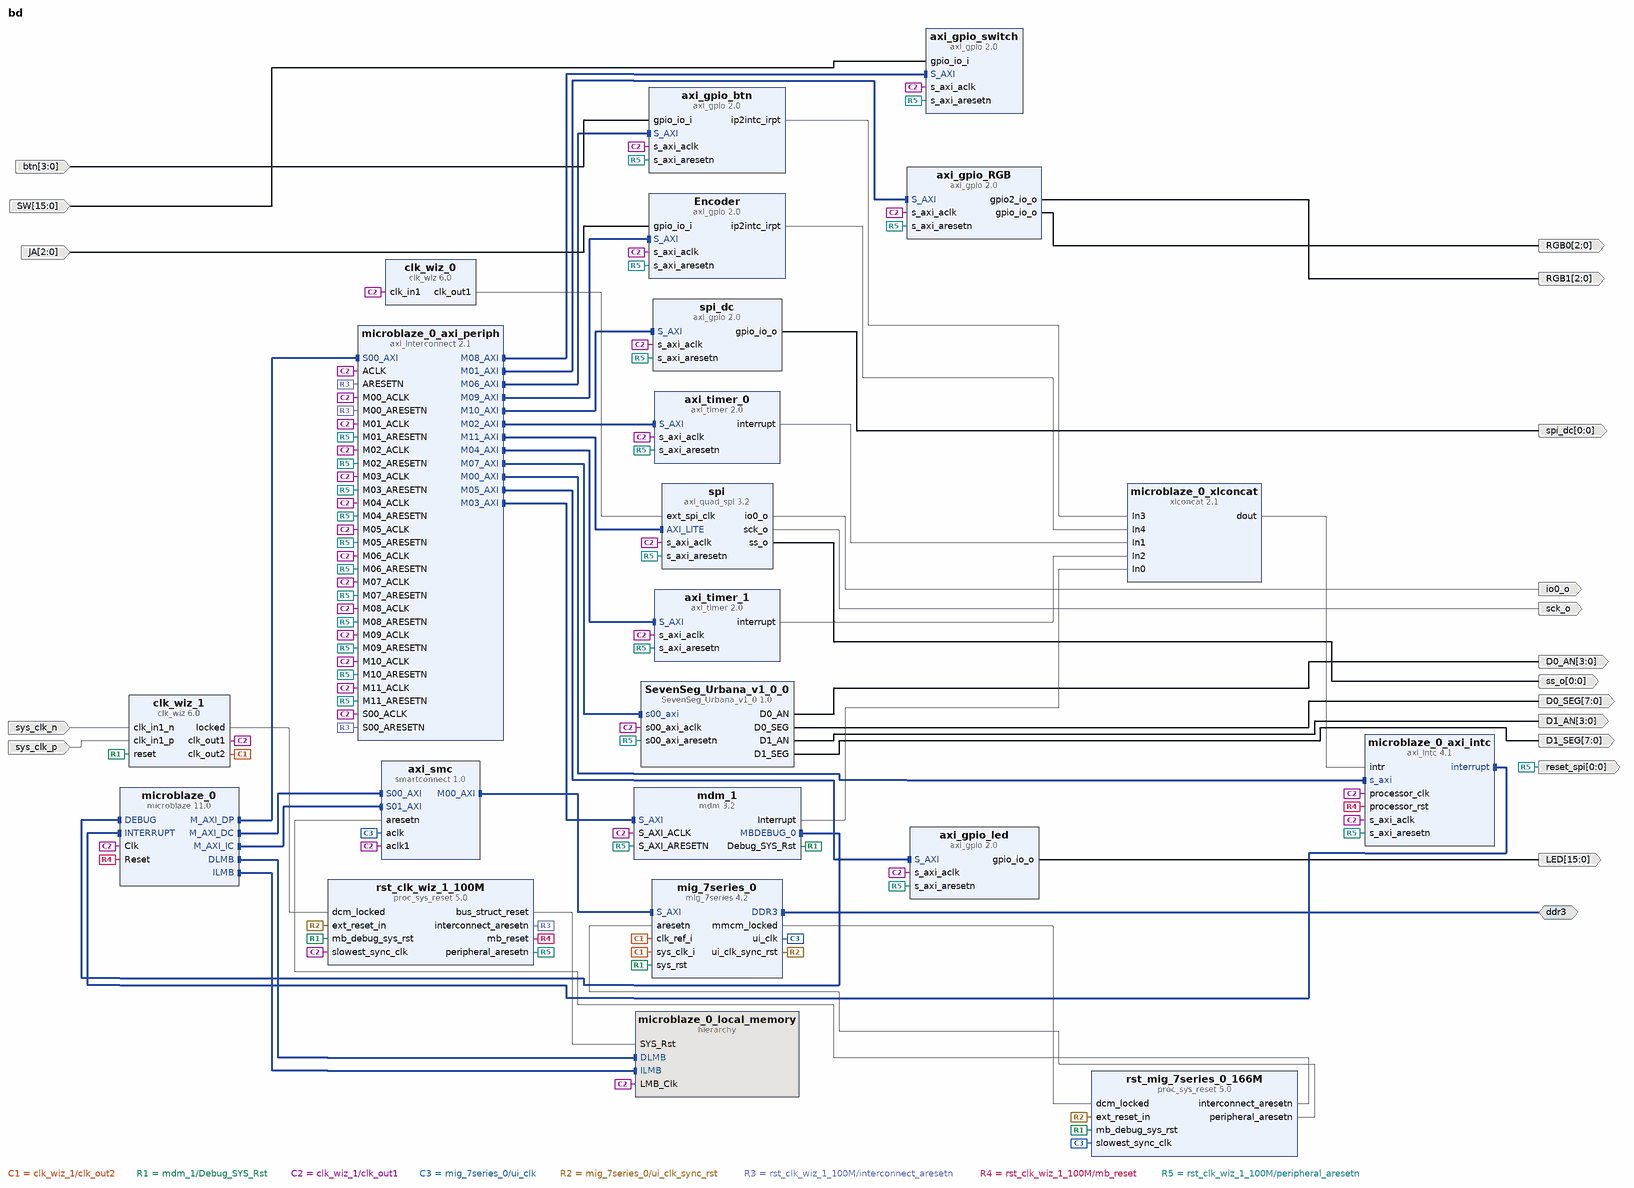
[diagram p0: block diagram of the top level]
# Vivado block design bd, xc7s50csga324-1, Vivado 2022.1
create_bd_design bd

create_bd_intf_port -mode Master -vlnv xilinx.com:interface:ddrx_rtl:1.0 ddr3
create_bd_port -dir O -from 2 -to 0 RGB0
create_bd_port -dir O -from 2 -to 0 RGB1
create_bd_port -dir I -type clk sys_clk_n
create_bd_port -dir I -type clk sys_clk_p
create_bd_port -dir O -from 15 -to 0 LED
create_bd_port -dir I -from 3 -to 0 btn
create_bd_port -dir O -from 3 -to 0 D0_AN
create_bd_port -dir O -from 3 -to 0 D1_AN
create_bd_port -dir O -from 7 -to 0 D0_SEG
create_bd_port -dir O -from 7 -to 0 D1_SEG
create_bd_port -dir I -from 15 -to 0 SW
create_bd_port -dir I -from 2 -to 0 JA
create_bd_port -dir O -from 0 -to 0 spi_dc
create_bd_port -dir O io0_o
create_bd_port -dir O sck_o
create_bd_port -dir O -from 0 -to 0 ss_o
create_bd_port -dir O -from 0 -to 0 reset_spi

create_bd_cell -type ip -vlnv xilinx.com:ip:axi_gpio:2.0 axi_gpio_RGB
set_property -dict [list \
  CONFIG.C_ALL_OUTPUTS 1 \
  CONFIG.C_ALL_OUTPUTS_2 1 \
  CONFIG.C_GPIO2_WIDTH 3 \
  CONFIG.C_GPIO_WIDTH 3 \
  CONFIG.C_IS_DUAL 1 \
] [get_bd_cells axi_gpio_RGB]
create_bd_cell -type ip -vlnv xilinx.com:ip:smartconnect:1.0 axi_smc
set_property -dict {CONFIG.NUM_CLKS 2 CONFIG.NUM_MI 1 CONFIG.NUM_SI 2} [get_bd_cells axi_smc]
create_bd_cell -type ip -vlnv xilinx.com:ip:axi_timer:2.0 axi_timer_0
set_property -dict {CONFIG.enable_timer2 1 CONFIG.mode_64bit 0} [get_bd_cells axi_timer_0]
create_bd_cell -type ip -vlnv xilinx.com:ip:clk_wiz:6.0 clk_wiz_1
set_property -dict [list \
  CONFIG.CLKOUT1_JITTER 130.958 \
  CONFIG.CLKOUT1_PHASE_ERROR 98.575 \
  CONFIG.CLKOUT2_JITTER 114.829 \
  CONFIG.CLKOUT2_PHASE_ERROR 98.575 \
  CONFIG.CLKOUT2_REQUESTED_OUT_FREQ 200.000 \
  CONFIG.CLKOUT2_USED true \
  CONFIG.CLKOUT3_JITTER 114.829 \
  CONFIG.CLKOUT3_PHASE_ERROR 98.575 \
  CONFIG.CLKOUT3_REQUESTED_OUT_FREQ 100.000 \
  CONFIG.CLKOUT3_USED false \
  CONFIG.MMCM_CLKFBOUT_MULT_F 10.000 \
  CONFIG.MMCM_CLKIN1_PERIOD 10.000 \
  CONFIG.MMCM_CLKIN2_PERIOD 10.000 \
  CONFIG.MMCM_CLKOUT0_DIVIDE_F 10.000 \
  CONFIG.MMCM_CLKOUT1_DIVIDE 5 \
  CONFIG.MMCM_CLKOUT2_DIVIDE 1 \
  CONFIG.MMCM_DIVCLK_DIVIDE 1 \
  CONFIG.NUM_OUT_CLKS 2 \
  CONFIG.PRIM_SOURCE Differential_clock_capable_pin \
  CONFIG.RESET_PORT reset \
  CONFIG.RESET_TYPE ACTIVE_HIGH \
] [get_bd_cells clk_wiz_1]
create_bd_cell -type ip -vlnv xilinx.com:ip:mdm:3.2 mdm_1
set_property -dict {CONFIG.C_ADDR_SIZE 32 CONFIG.C_M_AXI_ADDR_WIDTH 32 CONFIG.C_USE_UART 1} [get_bd_cells mdm_1]
create_bd_cell -type ip -vlnv xilinx.com:ip:microblaze:11.0 microblaze_0
set_property -dict [list \
  CONFIG.C_CACHE_BYTE_SIZE 8192 \
  CONFIG.C_DCACHE_BYTE_SIZE 8192 \
  CONFIG.C_DCACHE_USE_WRITEBACK 1 \
  CONFIG.C_DCACHE_VICTIMS 2 \
  CONFIG.C_DEBUG_ENABLED 1 \
  CONFIG.C_D_AXI 1 \
  CONFIG.C_D_LMB 1 \
  CONFIG.C_ICACHE_LINE_LEN 8 \
  CONFIG.C_I_LMB 1 \
  CONFIG.C_USE_BARREL 1 \
  CONFIG.C_USE_BRANCH_TARGET_CACHE 1 \
  CONFIG.C_USE_DCACHE 1 \
  CONFIG.C_USE_DIV 1 \
  CONFIG.C_USE_FPU 1 \
  CONFIG.C_USE_HW_MUL 1 \
  CONFIG.C_USE_ICACHE 1 \
] [get_bd_cells microblaze_0]
create_bd_cell -type ip -vlnv xilinx.com:ip:axi_intc:4.1 microblaze_0_axi_intc
set_property -dict {CONFIG.C_HAS_FAST 1} [get_bd_cells microblaze_0_axi_intc]
create_bd_cell -type ip -vlnv xilinx.com:ip:axi_interconnect:2.1 microblaze_0_axi_periph
set_property -dict {CONFIG.NUM_MI 12} [get_bd_cells microblaze_0_axi_periph]
create_bd_cell -type hier microblaze_0_local_memory
create_bd_cell -type ip -vlnv xilinx.com:ip:xlconcat:2.1 microblaze_0_xlconcat
set_property -dict {CONFIG.NUM_PORTS 5} [get_bd_cells microblaze_0_xlconcat]
create_bd_cell -type ip -vlnv xilinx.com:ip:mig_7series:4.2 mig_7series_0
set_property -dict [list \
  CONFIG.BOARD_MIG_PARAM Custom \
  CONFIG.MIG_DONT_TOUCH_PARAM Custom \
  CONFIG.RESET_BOARD_INTERFACE Custom \
  CONFIG.XML_INPUT_FILE mig_a.prj \
] [get_bd_cells mig_7series_0]
create_bd_cell -type ip -vlnv xilinx.com:ip:proc_sys_reset:5.0 rst_clk_wiz_1_100M
create_bd_cell -type ip -vlnv xilinx.com:ip:proc_sys_reset:5.0 rst_mig_7series_0_166M
create_bd_cell -type ip -vlnv xilinx.com:ip:axi_timer:2.0 axi_timer_1
create_bd_cell -type ip -vlnv xilinx.com:ip:axi_gpio:2.0 axi_gpio_led
set_property -dict {CONFIG.C_ALL_OUTPUTS 1 CONFIG.C_GPIO_WIDTH 16} [get_bd_cells axi_gpio_led]
create_bd_cell -type ip -vlnv xilinx.com:ip:axi_gpio:2.0 axi_gpio_btn
set_property -dict {CONFIG.C_ALL_INPUTS 1 CONFIG.C_GPIO_WIDTH 4 CONFIG.C_INTERRUPT_PRESENT 1} [get_bd_cells axi_gpio_btn]
create_bd_cell -type ip -vlnv xilinx.com:user:SevenSeg_Urbana_v1_0:1.0 SevenSeg_Urbana_v1_0_0
create_bd_cell -type ip -vlnv xilinx.com:ip:axi_gpio:2.0 axi_gpio_switch
set_property -dict {CONFIG.C_GPIO_WIDTH 16} [get_bd_cells axi_gpio_switch]
create_bd_cell -type ip -vlnv xilinx.com:ip:axi_gpio:2.0 Encoder
set_property -dict {CONFIG.C_ALL_INPUTS 1 CONFIG.C_GPIO_WIDTH 3 CONFIG.C_INTERRUPT_PRESENT 1} [get_bd_cells Encoder]
create_bd_cell -type ip -vlnv xilinx.com:ip:axi_gpio:2.0 spi_dc
set_property -dict {CONFIG.C_ALL_OUTPUTS 1 CONFIG.C_GPIO_WIDTH 1} [get_bd_cells spi_dc]
create_bd_cell -type ip -vlnv xilinx.com:ip:clk_wiz:6.0 clk_wiz_0
set_property -dict [list \
  CONFIG.CLKOUT1_JITTER 193.154 \
  CONFIG.CLKOUT1_PHASE_ERROR 109.126 \
  CONFIG.CLKOUT1_REQUESTED_OUT_FREQ 20.000 \
  CONFIG.CLKOUT2_JITTER 130.958 \
  CONFIG.CLKOUT2_PHASE_ERROR 98.575 \
  CONFIG.CLKOUT2_USED false \
  CONFIG.MMCM_CLKFBOUT_MULT_F 8.500 \
  CONFIG.MMCM_CLKOUT0_DIVIDE_F 42.500 \
  CONFIG.MMCM_CLKOUT1_DIVIDE 1 \
  CONFIG.MMCM_DIVCLK_DIVIDE 1 \
  CONFIG.NUM_OUT_CLKS 1 \
  CONFIG.USE_LOCKED false \
  CONFIG.USE_RESET false \
] [get_bd_cells clk_wiz_0]
create_bd_cell -type ip -vlnv xilinx.com:ip:axi_quad_spi:3.2 spi
set_property -dict {CONFIG.C_FIFO_DEPTH 256 CONFIG.C_SCK_RATIO 2 CONFIG.C_USE_STARTUP 0} [get_bd_cells spi]

# ---- hierarchy /microblaze_0_local_memory ----
current_bd_instance /microblaze_0_local_memory
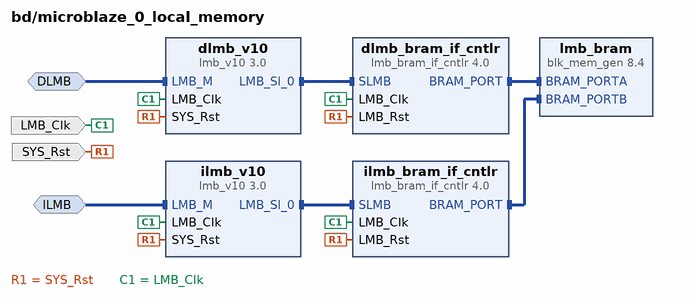
[diagram p1: block diagram inside /microblaze_0_local_memory]
create_bd_intf_pin -mode MirroredMaster -vlnv xilinx.com:interface:lmb_rtl:1.0 DLMB
create_bd_intf_pin -mode MirroredMaster -vlnv xilinx.com:interface:lmb_rtl:1.0 ILMB
create_bd_pin -dir I -type clk LMB_Clk
create_bd_pin -dir I -type rst SYS_Rst

create_bd_cell -type ip -vlnv xilinx.com:ip:lmb_bram_if_cntlr:4.0 dlmb_bram_if_cntlr
set_property -dict {CONFIG.C_ECC 0} [get_bd_cells dlmb_bram_if_cntlr]
create_bd_cell -type ip -vlnv xilinx.com:ip:lmb_v10:3.0 dlmb_v10
create_bd_cell -type ip -vlnv xilinx.com:ip:lmb_bram_if_cntlr:4.0 ilmb_bram_if_cntlr
set_property -dict {CONFIG.C_ECC 0} [get_bd_cells ilmb_bram_if_cntlr]
create_bd_cell -type ip -vlnv xilinx.com:ip:lmb_v10:3.0 ilmb_v10
create_bd_cell -type ip -vlnv xilinx.com:ip:blk_mem_gen:8.4 lmb_bram
set_property -dict {CONFIG.Memory_Type True_Dual_Port_RAM CONFIG.use_bram_block BRAM_Controller} [get_bd_cells lmb_bram]

# ---- connections ----

current_bd_instance /microblaze_0_local_memory
connect_bd_intf_net -intf_net microblaze_0_dlmb [get_bd_intf_pins DLMB] [get_bd_intf_pins dlmb_v10/LMB_M]
connect_bd_intf_net -intf_net microblaze_0_dlmb_bus [get_bd_intf_pins dlmb_bram_if_cntlr/SLMB] [get_bd_intf_pins dlmb_v10/LMB_Sl_0]
connect_bd_intf_net -intf_net microblaze_0_dlmb_cntlr [get_bd_intf_pins dlmb_bram_if_cntlr/BRAM_PORT] [get_bd_intf_pins lmb_bram/BRAM_PORTA]
connect_bd_intf_net -intf_net microblaze_0_ilmb [get_bd_intf_pins ILMB] [get_bd_intf_pins ilmb_v10/LMB_M]
connect_bd_intf_net -intf_net microblaze_0_ilmb_bus [get_bd_intf_pins ilmb_bram_if_cntlr/SLMB] [get_bd_intf_pins ilmb_v10/LMB_Sl_0]
connect_bd_intf_net -intf_net microblaze_0_ilmb_cntlr [get_bd_intf_pins ilmb_bram_if_cntlr/BRAM_PORT] [get_bd_intf_pins lmb_bram/BRAM_PORTB]
connect_bd_net [get_bd_pins SYS_Rst] \
  [get_bd_pins dlmb_bram_if_cntlr/LMB_Rst] [get_bd_pins dlmb_v10/SYS_Rst] [get_bd_pins ilmb_bram_if_cntlr/LMB_Rst] \
  [get_bd_pins ilmb_v10/SYS_Rst]
connect_bd_net -net microblaze_0_Clk [get_bd_pins LMB_Clk] \
  [get_bd_pins dlmb_bram_if_cntlr/LMB_Clk] [get_bd_pins dlmb_v10/LMB_Clk] [get_bd_pins ilmb_bram_if_cntlr/LMB_Clk] \
  [get_bd_pins ilmb_v10/LMB_Clk]
set_property HDL_ATTRIBUTE.BMM_INFO_ADDRESS_SPACE {byte  0x00000000 32 > bd microblaze_0_local_memory/lmb_bram} [get_bd_cells dlmb_bram_if_cntlr]
set_property HDL_ATTRIBUTE.KEEP_HIERARCHY yes [get_bd_cells dlmb_bram_if_cntlr]

current_bd_instance /
connect_bd_intf_net [get_bd_intf_pins axi_smc/M00_AXI] [get_bd_intf_pins mig_7series_0/S_AXI]
connect_bd_intf_net [get_bd_intf_pins axi_smc/S00_AXI] [get_bd_intf_pins microblaze_0/M_AXI_DC]
connect_bd_intf_net [get_bd_intf_pins axi_smc/S01_AXI] [get_bd_intf_pins microblaze_0/M_AXI_IC]
connect_bd_intf_net -intf_net microblaze_0_axi_dp [get_bd_intf_pins microblaze_0/M_AXI_DP] [get_bd_intf_pins microblaze_0_axi_periph/S00_AXI]
connect_bd_intf_net [get_bd_intf_pins axi_gpio_RGB/S_AXI] [get_bd_intf_pins microblaze_0_axi_periph/M01_AXI]
connect_bd_intf_net [get_bd_intf_pins axi_timer_0/S_AXI] [get_bd_intf_pins microblaze_0_axi_periph/M02_AXI]
connect_bd_intf_net [get_bd_intf_pins mdm_1/S_AXI] [get_bd_intf_pins microblaze_0_axi_periph/M03_AXI]
connect_bd_intf_net [get_bd_intf_pins microblaze_0_axi_periph/M04_AXI] [get_bd_intf_pins axi_timer_1/S_AXI]
connect_bd_intf_net [get_bd_intf_pins microblaze_0_axi_periph/M05_AXI] [get_bd_intf_pins axi_gpio_led/S_AXI]
connect_bd_intf_net [get_bd_intf_pins microblaze_0_axi_periph/M06_AXI] [get_bd_intf_pins axi_gpio_btn/S_AXI]
connect_bd_intf_net [get_bd_intf_pins SevenSeg_Urbana_v1_0_0/s00_axi] [get_bd_intf_pins microblaze_0_axi_periph/M07_AXI]
connect_bd_intf_net [get_bd_intf_pins microblaze_0_axi_periph/M08_AXI] [get_bd_intf_pins axi_gpio_switch/S_AXI]
connect_bd_intf_net [get_bd_intf_pins microblaze_0_axi_periph/M09_AXI] [get_bd_intf_pins Encoder/S_AXI]
connect_bd_intf_net [get_bd_intf_pins microblaze_0_axi_periph/M10_AXI] [get_bd_intf_pins spi_dc/S_AXI]
connect_bd_intf_net [get_bd_intf_pins microblaze_0_axi_periph/M11_AXI] [get_bd_intf_pins spi/AXI_LITE]
connect_bd_intf_net [get_bd_intf_pins mdm_1/MBDEBUG_0] [get_bd_intf_pins microblaze_0/DEBUG]
connect_bd_intf_net [get_bd_intf_pins microblaze_0/DLMB] [get_bd_intf_pins microblaze_0_local_memory/DLMB]
connect_bd_intf_net [get_bd_intf_pins microblaze_0/ILMB] [get_bd_intf_pins microblaze_0_local_memory/ILMB]
connect_bd_intf_net -intf_net microblaze_0_intc_axi [get_bd_intf_pins microblaze_0_axi_intc/s_axi] [get_bd_intf_pins microblaze_0_axi_periph/M00_AXI]
connect_bd_intf_net [get_bd_intf_pins microblaze_0/INTERRUPT] [get_bd_intf_pins microblaze_0_axi_intc/interrupt]
connect_bd_intf_net [get_bd_intf_ports ddr3] [get_bd_intf_pins mig_7series_0/DDR3]
connect_bd_net [get_bd_pins Encoder/ip2intc_irpt] [get_bd_pins microblaze_0_xlconcat/In4]
connect_bd_net [get_bd_pins SevenSeg_Urbana_v1_0_0/D0_AN] [get_bd_ports D0_AN]
connect_bd_net [get_bd_pins SevenSeg_Urbana_v1_0_0/D0_SEG] [get_bd_ports D0_SEG]
connect_bd_net [get_bd_pins SevenSeg_Urbana_v1_0_0/D1_AN] [get_bd_ports D1_AN]
connect_bd_net [get_bd_pins SevenSeg_Urbana_v1_0_0/D1_SEG] [get_bd_ports D1_SEG]
connect_bd_net -net axi_gpio_1_gpio2_io_o [get_bd_pins axi_gpio_RGB/gpio2_io_o] [get_bd_ports RGB1]
connect_bd_net -net axi_gpio_1_gpio_io_o [get_bd_pins axi_gpio_RGB/gpio_io_o] [get_bd_ports RGB0]
connect_bd_net [get_bd_pins axi_gpio_btn/ip2intc_irpt] [get_bd_pins microblaze_0_xlconcat/In3]
connect_bd_net [get_bd_pins axi_timer_0/interrupt] [get_bd_pins microblaze_0_xlconcat/In1]
connect_bd_net [get_bd_pins axi_timer_1/interrupt] [get_bd_pins microblaze_0_xlconcat/In2]
connect_bd_net -net clk_in1_n_0_1 [get_bd_ports sys_clk_n] [get_bd_pins clk_wiz_1/clk_in1_n]
connect_bd_net -net clk_in1_p_0_1 [get_bd_ports sys_clk_p] [get_bd_pins clk_wiz_1/clk_in1_p]
connect_bd_net [get_bd_pins clk_wiz_0/clk_out1] [get_bd_pins spi/ext_spi_clk]
connect_bd_net [get_bd_pins clk_wiz_1/clk_out2] [get_bd_pins mig_7series_0/clk_ref_i] [get_bd_pins mig_7series_0/sys_clk_i]
connect_bd_net [get_bd_pins clk_wiz_1/locked] [get_bd_pins rst_clk_wiz_1_100M/dcm_locked]
connect_bd_net -net gpio_io_i_0_1 [get_bd_ports btn] [get_bd_pins axi_gpio_btn/gpio_io_i]
connect_bd_net -net gpio_io_i_0_2 [get_bd_ports SW] [get_bd_pins axi_gpio_switch/gpio_io_i]
connect_bd_net -net gpio_io_i_0_3 [get_bd_ports JA] [get_bd_pins Encoder/gpio_io_i]
connect_bd_net -net gpio_io_o_0 [get_bd_pins axi_gpio_led/gpio_io_o] [get_bd_ports LED]
connect_bd_net [get_bd_pins mdm_1/Interrupt] [get_bd_pins microblaze_0_xlconcat/In0]
connect_bd_net [get_bd_pins mdm_1/Debug_SYS_Rst] \
  [get_bd_pins clk_wiz_1/reset] [get_bd_pins mig_7series_0/sys_rst] [get_bd_pins rst_clk_wiz_1_100M/mb_debug_sys_rst] \
  [get_bd_pins rst_mig_7series_0_166M/mb_debug_sys_rst]
connect_bd_net -net microblaze_0_Clk [get_bd_pins clk_wiz_1/clk_out1] \
  [get_bd_pins axi_gpio_RGB/s_axi_aclk] [get_bd_pins axi_smc/aclk1] [get_bd_pins axi_timer_0/s_axi_aclk] \
  [get_bd_pins mdm_1/S_AXI_ACLK] [get_bd_pins microblaze_0/Clk] [get_bd_pins microblaze_0_axi_intc/processor_clk] \
  [get_bd_pins microblaze_0_axi_intc/s_axi_aclk] [get_bd_pins microblaze_0_axi_periph/ACLK] \
  [get_bd_pins microblaze_0_axi_periph/M00_ACLK] [get_bd_pins microblaze_0_axi_periph/M01_ACLK] \
  [get_bd_pins microblaze_0_axi_periph/M02_ACLK] [get_bd_pins microblaze_0_axi_periph/M03_ACLK] \
  [get_bd_pins microblaze_0_axi_periph/S00_ACLK] [get_bd_pins microblaze_0_local_memory/LMB_Clk] \
  [get_bd_pins rst_clk_wiz_1_100M/slowest_sync_clk] [get_bd_pins axi_timer_1/s_axi_aclk] \
  [get_bd_pins microblaze_0_axi_periph/M04_ACLK] [get_bd_pins axi_gpio_led/s_axi_aclk] \
  [get_bd_pins microblaze_0_axi_periph/M05_ACLK] [get_bd_pins axi_gpio_btn/s_axi_aclk] \
  [get_bd_pins microblaze_0_axi_periph/M06_ACLK] [get_bd_pins microblaze_0_axi_periph/M07_ACLK] \
  [get_bd_pins SevenSeg_Urbana_v1_0_0/s00_axi_aclk] [get_bd_pins microblaze_0_axi_periph/M08_ACLK] \
  [get_bd_pins axi_gpio_switch/s_axi_aclk] [get_bd_pins Encoder/s_axi_aclk] [get_bd_pins microblaze_0_axi_periph/M09_ACLK] \
  [get_bd_pins spi_dc/s_axi_aclk] [get_bd_pins microblaze_0_axi_periph/M10_ACLK] [get_bd_pins clk_wiz_0/clk_in1] \
  [get_bd_pins spi/s_axi_aclk] [get_bd_pins microblaze_0_axi_periph/M11_ACLK]
connect_bd_net -net microblaze_0_intr [get_bd_pins microblaze_0_xlconcat/dout] [get_bd_pins microblaze_0_axi_intc/intr]
connect_bd_net [get_bd_pins mig_7series_0/mmcm_locked] [get_bd_pins rst_mig_7series_0_166M/dcm_locked]
connect_bd_net [get_bd_pins mig_7series_0/ui_clk] [get_bd_pins axi_smc/aclk] [get_bd_pins rst_mig_7series_0_166M/slowest_sync_clk]
connect_bd_net [get_bd_pins mig_7series_0/ui_clk_sync_rst] \
  [get_bd_pins rst_clk_wiz_1_100M/ext_reset_in] [get_bd_pins rst_mig_7series_0_166M/ext_reset_in]
connect_bd_net [get_bd_pins rst_clk_wiz_1_100M/bus_struct_reset] [get_bd_pins microblaze_0_local_memory/SYS_Rst]
connect_bd_net [get_bd_pins rst_clk_wiz_1_100M/interconnect_aresetn] \
  [get_bd_pins microblaze_0_axi_periph/ARESETN] [get_bd_pins microblaze_0_axi_periph/M00_ARESETN] \
  [get_bd_pins microblaze_0_axi_periph/S00_ARESETN]
connect_bd_net [get_bd_pins rst_clk_wiz_1_100M/mb_reset] [get_bd_pins microblaze_0/Reset] [get_bd_pins microblaze_0_axi_intc/processor_rst]
connect_bd_net [get_bd_pins rst_clk_wiz_1_100M/peripheral_aresetn] \
  [get_bd_pins axi_gpio_RGB/s_axi_aresetn] [get_bd_pins axi_timer_0/s_axi_aresetn] [get_bd_pins mdm_1/S_AXI_ARESETN] \
  [get_bd_pins microblaze_0_axi_intc/s_axi_aresetn] [get_bd_pins microblaze_0_axi_periph/M01_ARESETN] \
  [get_bd_pins microblaze_0_axi_periph/M02_ARESETN] [get_bd_pins microblaze_0_axi_periph/M03_ARESETN] \
  [get_bd_pins axi_timer_1/s_axi_aresetn] [get_bd_pins microblaze_0_axi_periph/M04_ARESETN] \
  [get_bd_pins axi_gpio_led/s_axi_aresetn] [get_bd_pins microblaze_0_axi_periph/M05_ARESETN] \
  [get_bd_pins axi_gpio_btn/s_axi_aresetn] [get_bd_pins microblaze_0_axi_periph/M06_ARESETN] \
  [get_bd_pins microblaze_0_axi_periph/M07_ARESETN] [get_bd_pins SevenSeg_Urbana_v1_0_0/s00_axi_aresetn] \
  [get_bd_pins microblaze_0_axi_periph/M08_ARESETN] [get_bd_pins axi_gpio_switch/s_axi_aresetn] \
  [get_bd_pins Encoder/s_axi_aresetn] [get_bd_pins microblaze_0_axi_periph/M09_ARESETN] [get_bd_pins spi_dc/s_axi_aresetn] \
  [get_bd_pins microblaze_0_axi_periph/M10_ARESETN] [get_bd_pins spi/s_axi_aresetn] \
  [get_bd_pins microblaze_0_axi_periph/M11_ARESETN] [get_bd_ports reset_spi]
connect_bd_net [get_bd_pins rst_mig_7series_0_166M/interconnect_aresetn] [get_bd_pins axi_smc/aresetn]
connect_bd_net [get_bd_pins rst_mig_7series_0_166M/peripheral_aresetn] [get_bd_pins mig_7series_0/aresetn]
connect_bd_net [get_bd_pins spi_dc/gpio_io_o] [get_bd_ports spi_dc]
connect_bd_net [get_bd_pins spi/io0_o] [get_bd_ports io0_o]
connect_bd_net [get_bd_pins spi/sck_o] [get_bd_ports sck_o]
connect_bd_net [get_bd_pins spi/ss_o] [get_bd_ports ss_o]
set_property HDL_ATTRIBUTE.BMM_INFO_PROCESSOR {microblaze-le > bd microblaze_0_local_memory/dlmb_bram_if_cntlr} [get_bd_cells microblaze_0]
set_property HDL_ATTRIBUTE.KEEP_HIERARCHY yes [get_bd_cells microblaze_0]

# ---- address map ----
assign_bd_address -offset 0x00000000 -range 64K -target_address_space [get_bd_addr_spaces microblaze_0/Data] [get_bd_addr_segs microblaze_0_local_memory/dlmb_bram_if_cntlr/SLMB/Mem]
assign_bd_address -offset 0x00010000 -range 4K -target_address_space [get_bd_addr_spaces microblaze_0/Data] [get_bd_addr_segs SevenSeg_Urbana_v1_0_0/s00_axi/reg0]
assign_bd_address -offset 0x40000000 -range 64K -target_address_space [get_bd_addr_spaces microblaze_0/Data] [get_bd_addr_segs axi_gpio_RGB/S_AXI/Reg]
assign_bd_address -offset 0x40010000 -range 64K -target_address_space [get_bd_addr_spaces microblaze_0/Data] [get_bd_addr_segs axi_gpio_led/S_AXI/Reg]
assign_bd_address -offset 0x40020000 -range 64K -target_address_space [get_bd_addr_spaces microblaze_0/Data] [get_bd_addr_segs axi_gpio_btn/S_AXI/Reg]
assign_bd_address -offset 0x40030000 -range 64K -target_address_space [get_bd_addr_spaces microblaze_0/Data] [get_bd_addr_segs Encoder/S_AXI/Reg]
assign_bd_address -offset 0x40040000 -range 64K -target_address_space [get_bd_addr_spaces microblaze_0/Data] [get_bd_addr_segs axi_gpio_switch/S_AXI/Reg]
assign_bd_address -offset 0x40050000 -range 64K -target_address_space [get_bd_addr_spaces microblaze_0/Data] [get_bd_addr_segs spi_dc/S_AXI/Reg]
assign_bd_address -offset 0x41200000 -range 64K -target_address_space [get_bd_addr_spaces microblaze_0/Data] [get_bd_addr_segs microblaze_0_axi_intc/S_AXI/Reg]
assign_bd_address -offset 0x41400000 -range 4K -target_address_space [get_bd_addr_spaces microblaze_0/Data] [get_bd_addr_segs mdm_1/S_AXI/Reg]
assign_bd_address -offset 0x41C00000 -range 64K -target_address_space [get_bd_addr_spaces microblaze_0/Data] [get_bd_addr_segs axi_timer_0/S_AXI/Reg]
assign_bd_address -offset 0x41C10000 -range 64K -target_address_space [get_bd_addr_spaces microblaze_0/Data] [get_bd_addr_segs axi_timer_1/S_AXI/Reg]
assign_bd_address -offset 0x44A00000 -range 64K -target_address_space [get_bd_addr_spaces microblaze_0/Data] [get_bd_addr_segs spi/AXI_LITE/Reg]
assign_bd_address -offset 0x80000000 -range 128M -target_address_space [get_bd_addr_spaces microblaze_0/Data] [get_bd_addr_segs mig_7series_0/memmap/memaddr]
assign_bd_address -offset 0x00000000 -range 64K -target_address_space [get_bd_addr_spaces microblaze_0/Instruction] [get_bd_addr_segs microblaze_0_local_memory/ilmb_bram_if_cntlr/SLMB/Mem]
assign_bd_address -offset 0x80000000 -range 128M -target_address_space [get_bd_addr_spaces microblaze_0/Instruction] [get_bd_addr_segs mig_7series_0/memmap/memaddr]

validate_bd_design
save_bd_design
